# Altium schematic sheet Top.SchDoc
size A4
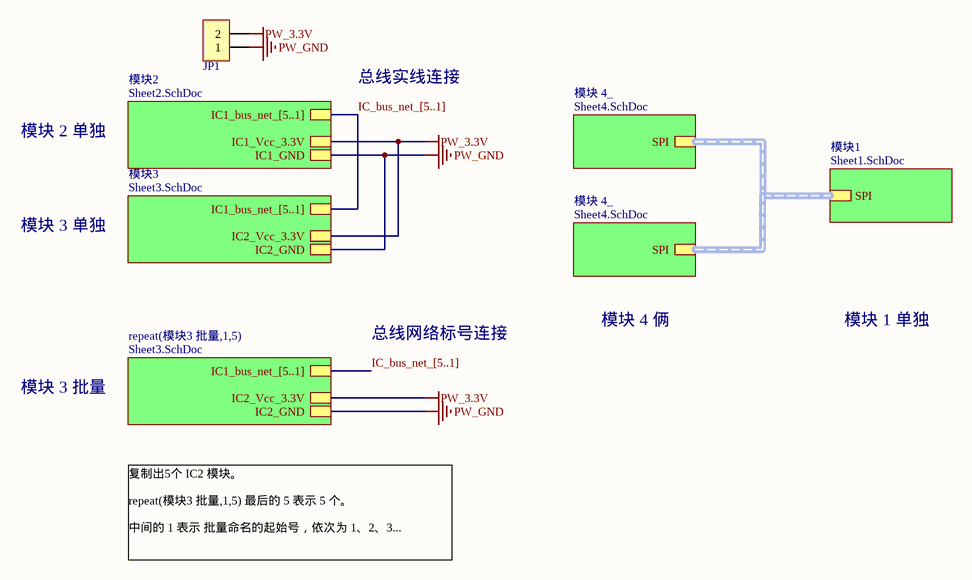
[diagram p0: Top.SchDoc]

## Parts
JP1  HDR-1X2  [HDR2.54-LI-2P]  (value not drawn)

## Sub-sheets
repeat(模块3 批量,1,5) = Sheet3.SchDoc: IC1_bus_net_[5..1], IC2_Vcc_3.3V, IC2_GND
模块1 = Sheet1.SchDoc: SPI (harness SPI)
模块2 = Sheet2.SchDoc: IC1_bus_net_[5..1], IC1_Vcc_3.3V, IC1_GND
模块3 = Sheet3.SchDoc: IC1_bus_net_[5..1], IC2_Vcc_3.3V, IC2_GND
模块 4_ = Sheet4.SchDoc: SPI (harness SPI)
模块 4_ = Sheet4.SchDoc: SPI (harness SPI)

## Nets
PW_3.3V: JP1.2 ; sheet 模块2/IC1_Vcc_3.3V, sheet 模块3/IC2_Vcc_3.3V, sheet repeat(模块3 批量,1,5)/IC2_Vcc_3.3V
PW_GND: JP1.1 ; sheet 模块2/IC1_GND, sheet 模块3/IC2_GND, sheet repeat(模块3 批量,1,5)/IC2_GND

## Buses and harness runs
bus IC_bus_net_[5..1] = sheet repeat(模块3 批量,1,5)/IC1_bus_net_[5..1]
bus IC_bus_net_[5..1] = sheet 模块2/IC1_bus_net_[5..1] = sheet 模块3/IC1_bus_net_[5..1]
harness sheet 模块1/SPI = sheet 模块 4_/SPI

## Notes on the sheet
- 总线实线连接
- 模块 2 单独
- 模块 3 单独
- 总线网络标号连接
- 模块 4 俩
- 模块 1 单独
- 模块 3 批量
- 复制出5个 IC2 模块。
  repeat(模块3 批量,1,5) 最后的 5 表示 5 个。
  中间的 1 表示 批量命名的起始号，依次为 1、2、3...

## Library data of the parts
JP1 = Header 2: 2P接插件; 版权归属: 源创客; BOM名称: 2P接插件; 学习资源: www.ooocke.com